# EAGLE schematic Indev 1 (EAGLE 6.3)
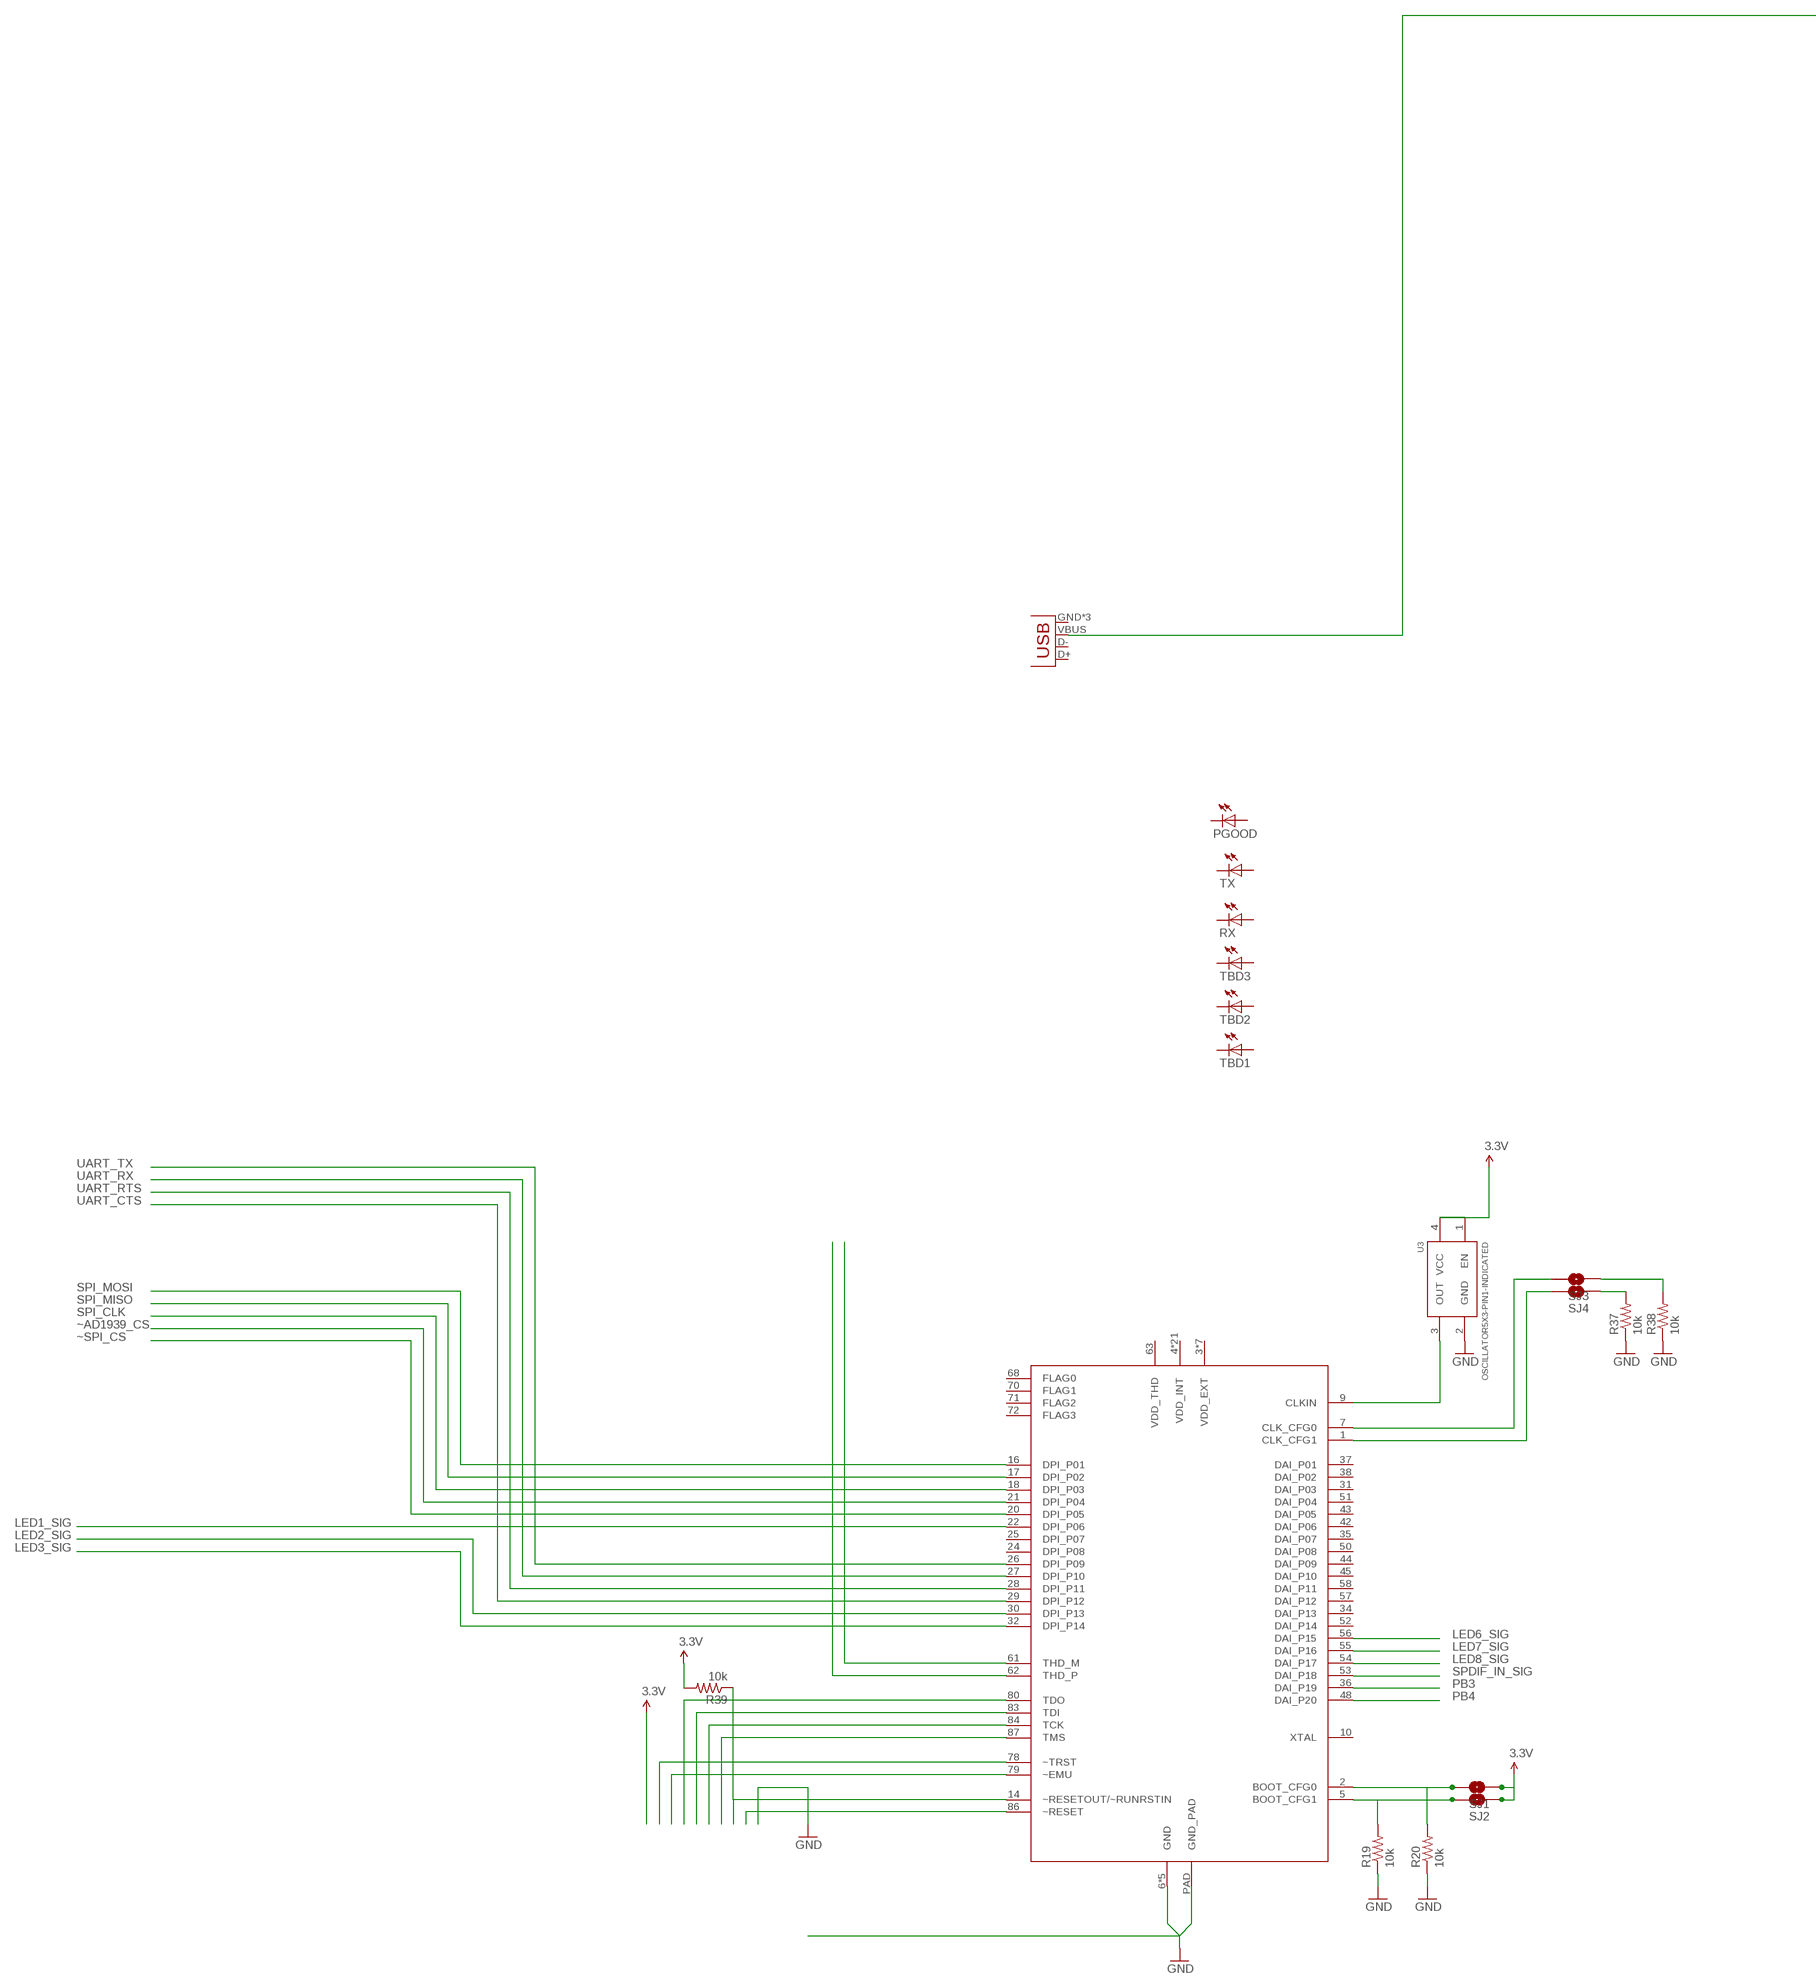
[diagram p0: schematic, sheet 1, part 1 of 2]
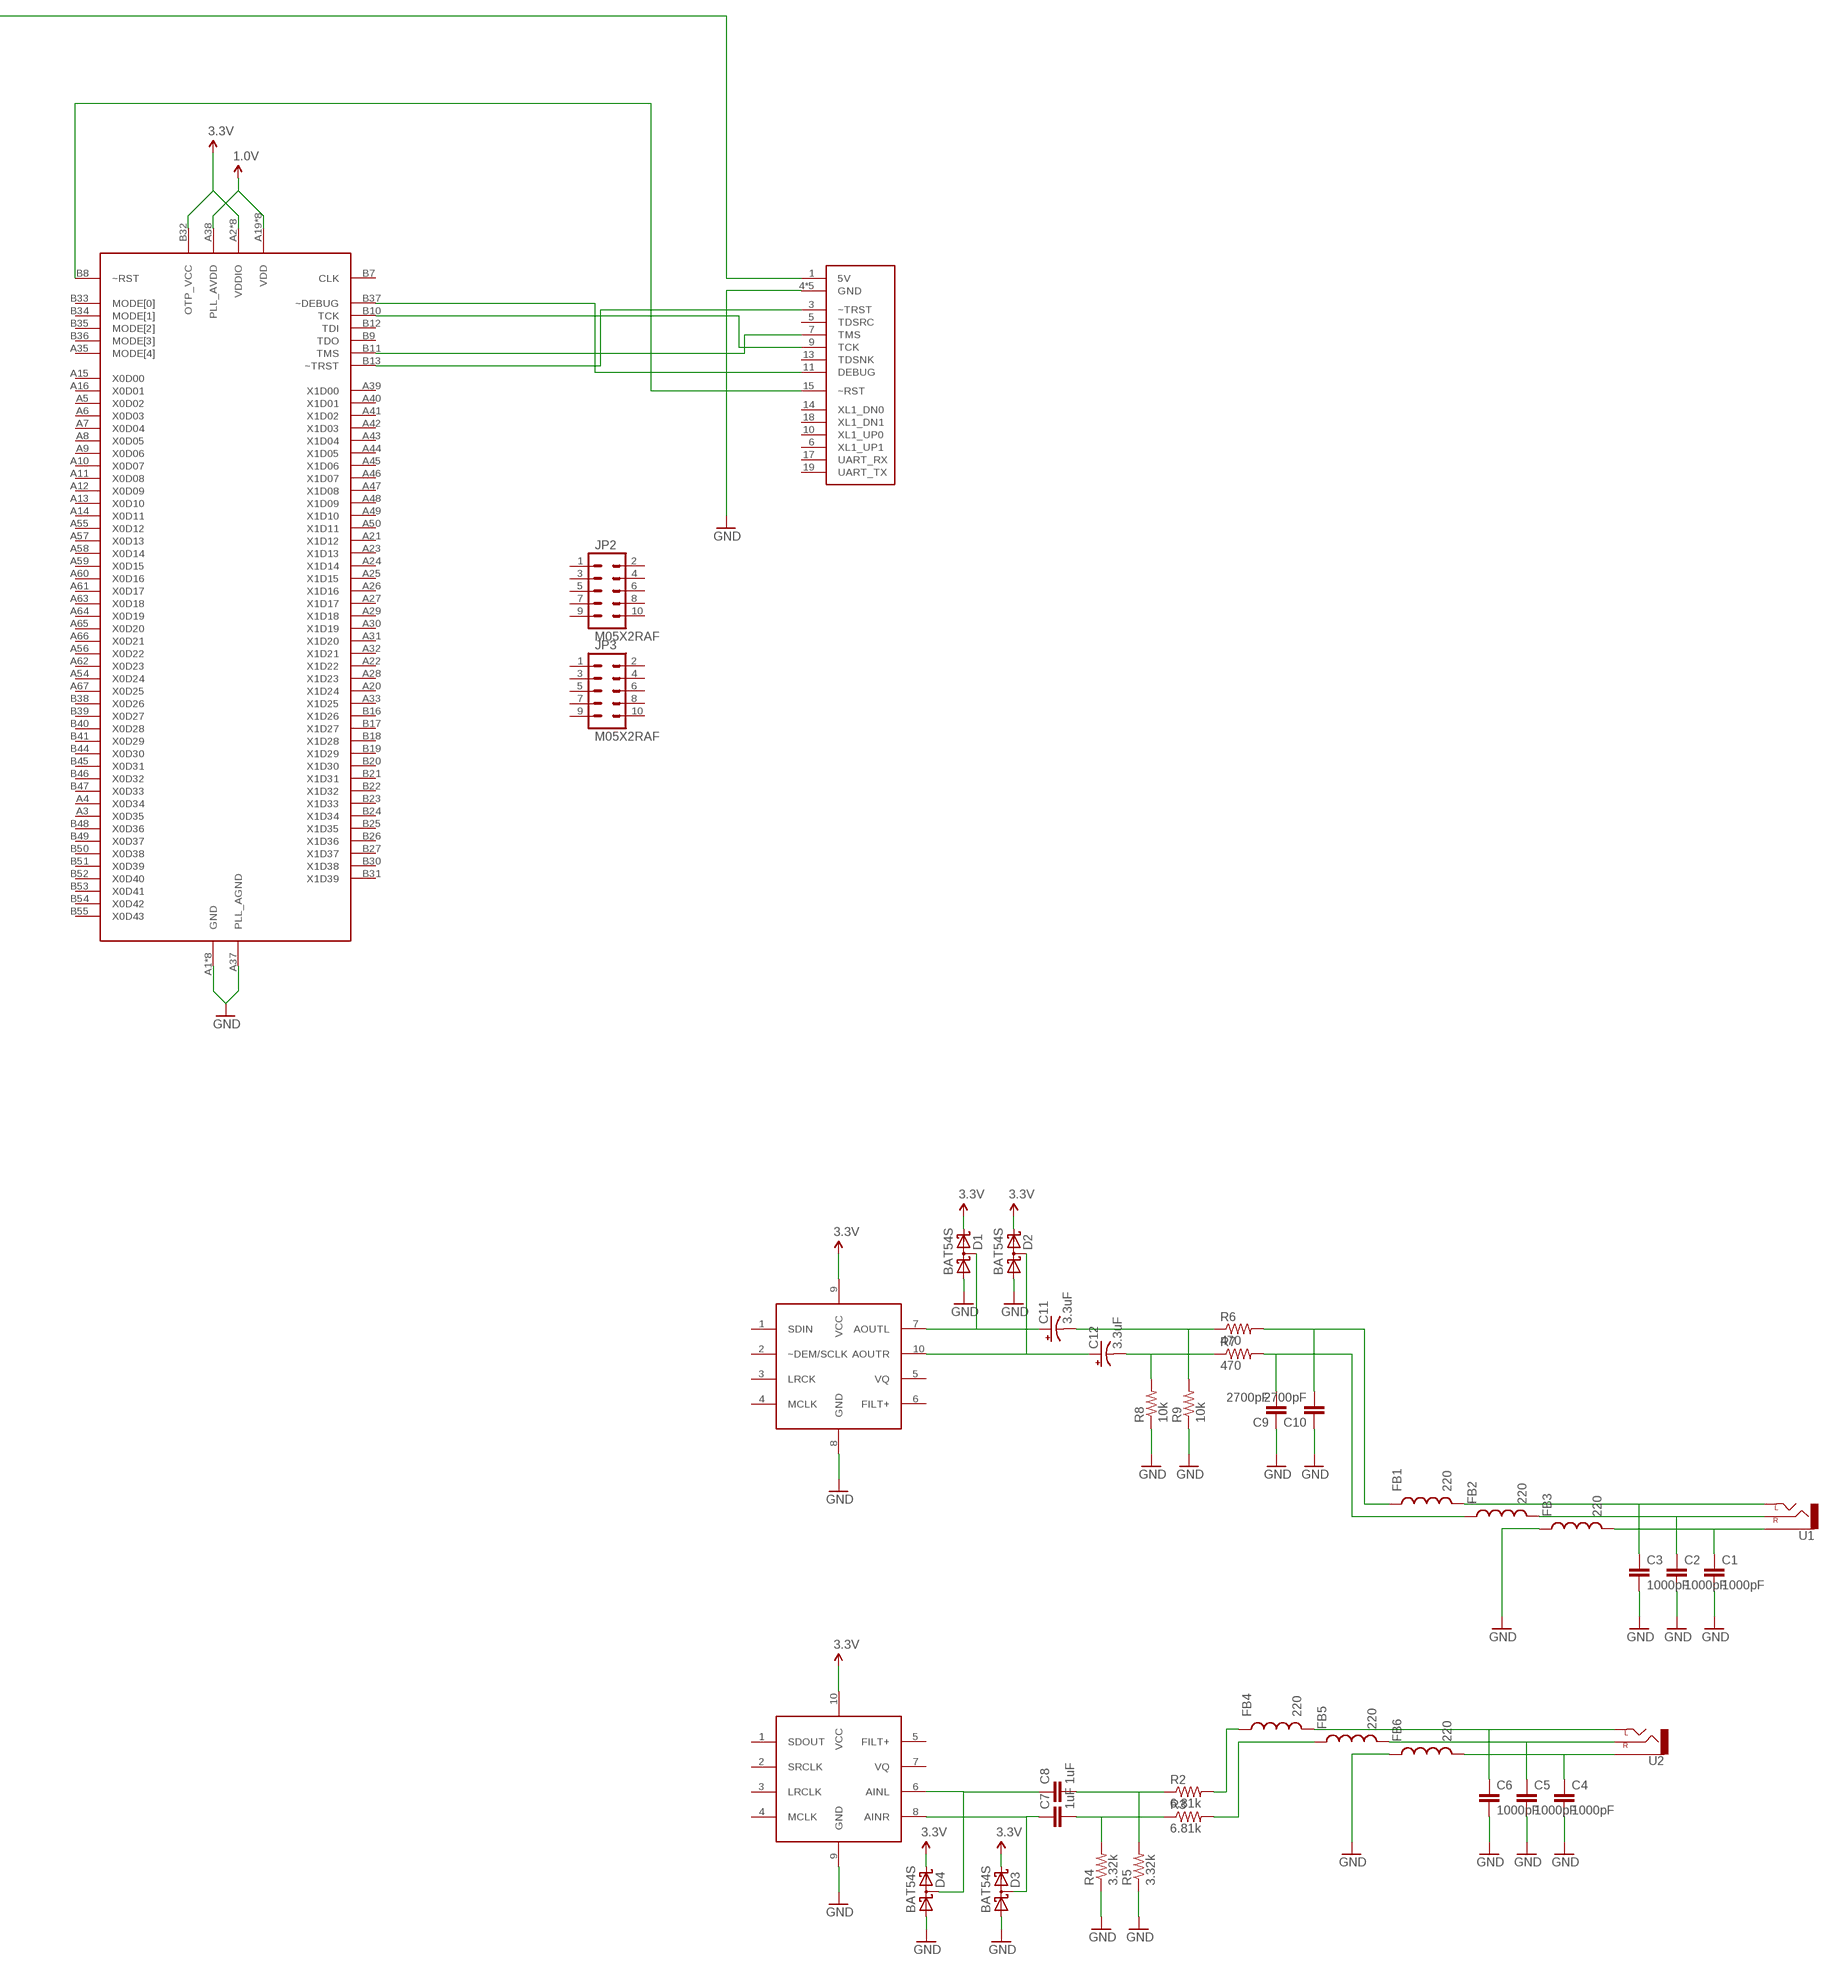
[diagram p1: schematic, sheet 1, part 2 of 2]

## Parts
C1  1000pF  CAP0402-CAP  [0402-CAP]
C2  1000pF  CAP0402-CAP  [0402-CAP]
C3  1000pF  CAP0402-CAP  [0402-CAP]
C4  1000pF  CAP0402-CAP  [0402-CAP]
C5  1000pF  CAP0402-CAP  [0402-CAP]
C6  1000pF  CAP0402-CAP  [0402-CAP]
C7  1uF  CAP0402-CAP  [0402-CAP]
C8  1uF  CAP0402-CAP  [0402-CAP]
C9  2700pF  CAP0402-CAP  [0402-CAP]
C10  2700pF  CAP0402-CAP  [0402-CAP]
C11  3.3uF  CAP_POL1206  [EIA3216]
C12  3.3uF  CAP_POL1206  [EIA3216]
D1  BAT54S  [SOT23]
D2  BAT54S  [SOT23]
D3  BAT54S  [SOT23]
D4  BAT54S  [SOT23]
FB1  220  INDUCTOR0805  [0805]
FB2  220  INDUCTOR0805  [0805]
FB3  220  INDUCTOR0805  [0805]
FB4  220  INDUCTOR0805  [0805]
FB5  220  INDUCTOR0805  [0805]
FB6  220  INDUCTOR0805  [0805]
JP1  USB-MICROB  [USB-MICROB]
JP2  M05X2RAF  [2X5-RAF]
JP3  M05X2RAF  [2X5-RAF]
PGOOD  LEDCHIP-LED0603  [CHIP-LED0603]
R2  6.81k  RESISTOR0603-RES  [0603-RES]
R3  6.81k  RESISTOR0603-RES  [0603-RES]
R4  3.32k  RESISTOR0603-RES  [0603-RES]
R5  3.32k  RESISTOR0603-RES  [0603-RES]
R6  470  RESISTOR0603-RES  [0603-RES]
R7  470  RESISTOR0603-RES  [0603-RES]
R8  10k  RESISTOR0603-RES  [0603-RES]
R9  10k  RESISTOR0603-RES  [0603-RES]
R19  10k  RESISTOR0603-RES  [0603-RES]
R20  10k  RESISTOR0603-RES  [0603-RES]
R37  10k  RESISTOR0603-RES  [0603-RES]
R38  10k  RESISTOR0603-RES  [0603-RES]
R39  10k  RESISTOR0603-RES  [0603-RES]
RX  LEDCHIP-LED0603  [CHIP-LED0603]
SJ1  SOLDERJUMPERNC  [SJ_2S]
SJ2  SOLDERJUMPERNC  [SJ_2S]
SJ3  SOLDERJUMPERNC  [SJ_2S]
SJ4  SOLDERJUMPERNC  [SJ_2S]
TBD1  LEDCHIP-LED0603  [CHIP-LED0603]
TBD2  LEDCHIP-LED0603  [CHIP-LED0603]
TBD3  LEDCHIP-LED0603  [CHIP-LED0603]
TX  LEDCHIP-LED0603  [CHIP-LED0603]
U1  AUDIO-JACKSMD2  [AUDIO-JACK-3.5MM-SMD]
U2  AUDIO-JACKSMD2  [AUDIO-JACK-3.5MM-SMD]
U3  OSCILLATOR5X3-PIN1-INDICATED  [CRYSTAL-OSC-SMD-5X3]
U$1  ADSP-21479  [QFN-88]
U$2  CS4344-DAC  [TSSOP-10]
U$3  CS5343  [TSSOP-10]
U$4  XTAG-2  [MOLEX-52745-2097]
U$6  XS1-L8A-128-QF124  [QFN-124]

## Nets
1.0V: U$6.A19(VDD) U$6.A34(VDD) U$6.A38(PLL_AVDD) U$6.A53(VDD) U$6.A68(VDD) U$6.B15(VDD) U$6.B28(VDD) U$6.B43(VDD) U$6.B56(VDD)
3.3V: R39.2 SJ1.1 SJ2.1 U3.1(EN) U3.4(VCC) U$6.A2(VDDIO) U$6.A17(VDDIO) U$6.A36(VDDIO) U$6.A51(VDDIO) U$6.B1(VDDIO) U$6.B14(VDDIO) U$6.B29(VDDIO) U$6.B32(OTP_VCC) U$6.B42(VDDIO)
AIN_SLEEV: C4.1 FB6.2 U2.SLEEVE
AINL: C6.1 FB4.2 U2.TIP(LEFT)
AINL_C: C8.1 D4.3(C1A2) U$3.6(AINL)
AINL_FB: FB4.1 R2.2
AINL_R: C8.2 R2.1 R5.2
AINR: C5.1 FB5.2 U2.RING(RIGHT)
AINR_C: C7.1 D3.3(C1A2) U$3.8(AINR)
AINR_FB: FB5.1 R3.2
AINR_R: C7.2 R3.1 R4.2
AOUTL: C3.1 FB1.2 U1.TIP(LEFT)
AOUTL_C: C11.A(+) D1.3(C1A2) U$2.7(AOUTL)
AOUTL_FB: C10.2 FB1.1 R6.2
AOUTL_R: C11.C(-) R6.1 R9.2
AOUTR: C2.1 FB2.2 U1.RING(RIGHT)
AOUTR_C: C12.A(+) D2.3(C1A2) U$2.10(AOUTR)
AOUTR_FB: C9.2 FB2.1 R7.2
AOUTR_R: C12.C(-) R7.1 R8.2
AOUTS: C1.1 FB3.2 U1.SLEEVE
GND: C1.2 C2.2 C3.2 C4.2 C5.2 C6.2 C9.1 C10.1 D1.1(A1) D2.1(A1) D3.1(A1) D4.1(A1) FB3.1 FB6.1 R4.1 R5.1 R8.1 R9.1 R19.1 R20.1 R37.1 R38.1 U3.2(GND) U$1.6(GND) U$1.60(GND) U$1.73(GND) U$1.74(GND) U$1.76(GND) U$1.PAD(GND_PAD) U$2.8(GND) U$3.9(GND) U$4.4(GND) U$4.8(GND) U$4.12(GND) U$4.16(GND) U$4.20(GND) U$6.A1(GND) U$6.A18(GND) U$6.A37(PLL_AGND) U$6.A52(GND) U$6.B2(GND) U$6.B4(GND) U$6.B5(GND) U$6.B6(GND) U$6.PAD(GND)
LED1_SIG: U$1.22(DPI_P06)
LED2_SIG: U$1.30(DPI_P13)
LED3_SIG: U$1.32(DPI_P14)
LED6_SIG: U$1.56(DAI_P15)
LED7_SIG: U$1.55(DAI_P16)
LED8_SIG: U$1.54(DAI_P17)
N$1: U$1.78(~TRST)
N$2: JP1.VBUS U$4.1(5V)
N$3: U$4.11(DEBUG) U$6.B37(~DEBUG)
N$4: U3.3(OUT) U$1.9(CLKIN)
N$5: U$4.9(TCK) U$6.B10(TCK)
N$6: U$4.7(TMS) U$6.B11(TMS)
N$7: SJ3.2 U$1.7(CLK_CFG0)
N$8: SJ4.2 U$1.1(CLK_CFG1)
N$9: R37.2 SJ4.1
N$10: U$4.3(~TRST) U$6.B13(~TRST)
N$12: R38.2 SJ3.1
N$14: U$1.79(~EMU)
N$15: U$1.80(TDO)
N$16: U$4.15(~RST) U$6.B8(~RST)
N$18: U$1.83(TDI)
N$19: U$1.84(TCK)
N$20: R20.2 SJ1.2 U$1.2(BOOT_CFG0)
N$21: U$1.87(TMS)
N$25: R39.1 U$1.14(~RESETOUT/~RUNRSTIN)
N$26: U$1.61(THD_M)
N$28: U$1.86(~RESET)
N$37: R19.2 SJ2.2 U$1.5(BOOT_CFG1)
N$38: U$1.62(THD_P)
PB3: U$1.36(DAI_P19)
PB4: U$1.48(DAI_P20)
SPDIF_IN_SIG: U$1.53(DAI_P18)
SPI_CLK: U$1.18(DPI_P03)
SPI_MISO: U$1.17(DPI_P02)
SPI_MOSI: U$1.16(DPI_P01)
UART_CTS: U$1.29(DPI_P12)
UART_RTS: U$1.28(DPI_P11)
UART_RX: U$1.27(DPI_P10)
UART_TX: U$1.26(DPI_P09)
VCC: D1.2(C2) D2.2(C2) D3.2(C2) D4.2(C2) U$2.9(VCC) U$3.10(VCC) ; supply symbol labelled 3.3V
~AD1939_CS: U$1.21(DPI_P04)
~SPI_CS: U$1.20(DPI_P05)
Unconnected: JP1.D+ JP1.D- JP1.GND JP1.MT1(GND) JP1.MT2(GND) JP2.1 JP2.2 JP2.3 JP2.4 JP2.5 JP2.6 JP2.7 JP2.8 JP2.9 JP2.10 JP3.1 JP3.2 JP3.3 JP3.4 JP3.5 JP3.6 JP3.7 JP3.8 JP3.9 JP3.10 PGOOD.A PGOOD.C RX.A RX.C TBD1.A TBD1.C TBD2.A TBD2.C TBD3.A TBD3.C TX.A TX.C U$1.3(VDD_EXT) U$1.4(VDD_INT) U$1.8(VDD_INT) U$1.10(XTAL) U$1.11(VDD_EXT) U$1.12(VDD_INT) U$1.13(VDD_INT) U$1.15(VDD_INT) U$1.19(VDD_INT) U$1.23(VDD_EXT) U$1.24(DPI_P08) U$1.25(DPI_P07) U$1.31(DAI_P03) U$1.33(VDD_INT) U$1.34(DAI_P13) U$1.35(DAI_P07) U$1.37(DAI_P01) U$1.38(DAI_P02) U$1.39(VDD_INT) U$1.40(VDD_EXT) U$1.41(VDD_INT) U$1.42(DAI_P06) U$1.43(DAI_P05) U$1.44(DAI_P09) U$1.45(DAI_P10) U$1.46(VDD_INT) U$1.47(VDD_EXT) U$1.49(VDD_INT) U$1.50(DAI_P08) U$1.51(DAI_P04) U$1.52(DAI_P14) U$1.57(DAI_P12) U$1.58(DAI_P11) U$1.59(VDD_INT) U$1.63(VDD_THD) U$1.64(VDD_INT) U$1.65(VDD_INT) U$1.66(VDD_INT) U$1.67(VDD_INT) U$1.68(FLAG0) U$1.69(VDD_INT) U$1.70(FLAG1) U$1.71(FLAG2) U$1.72(FLAG3) U$1.75(VDD_EXT) U$1.77(VDD_INT) U$1.81(VDD_EXT) U$1.82(VDD_INT) U$1.85(VDD_INT) U$1.88(VDD_INT) U$2.1(SDIN) U$2.2(~DEM/SCLK) U$2.3(LRCK) U$2.4(MCLK) U$2.5(VQ) U$2.6(FILT+) U$3.1(SDOUT) U$3.2(SRCLK) U$3.3(LRCLK) U$3.4(MCLK) U$3.5(FILT+) U$3.7(VQ) U$4.5(TDSRC) U$4.6(XL1_UP1) U$4.10(XL1_UP0) U$4.13(TDSNK) U$4.14(XL1_DN0) U$4.17(UART_RX) U$4.18(XL1_DN1) U$4.19(UART_TX) U$6.A3(X0D35) U$6.A4(X0D34) U$6.A5(X0D02) U$6.A6(X0D03) U$6.A7(X0D04) U$6.A8(X0D05) U$6.A9(X0D06) U$6.A10(X0D07) U$6.A11(X0D08) U$6.A12(X0D09) U$6.A13(X0D10) U$6.A14(X0D11) U$6.A15(X0D00) U$6.A16(X0D01) U$6.A20(X1D24) U$6.A21(X1D12) U$6.A22(X1D22) U$6.A23(X1D13) U$6.A24(X1D14) U$6.A25(X1D15) U$6.A26(X1D16) U$6.A27(X1D17) U$6.A28(X1D23) U$6.A29(X1D18) U$6.A30(X1D19) U$6.A31(X1D20) U$6.A32(X1D21) U$6.A33(X1D25) U$6.A35(MODE[4]) U$6.A39(X1D00) U$6.A40(X1D01) U$6.A41(X1D02) U$6.A42(X1D03) U$6.A43(X1D04) U$6.A44(X1D05) U$6.A45(X1D06) U$6.A46(X1D07) U$6.A47(X1D08) U$6.A48(X1D09) U$6.A49(X1D10) U$6.A50(X1D11) U$6.A54(X0D24) U$6.A55(X0D12) U$6.A56(X0D22) U$6.A57(X0D13) U$6.A58(X0D14) U$6.A59(X0D15) U$6.A60(X0D16) U$6.A61(X0D17) U$6.A62(X0D23) U$6.A63(X0D18) U$6.A64(X0D19) U$6.A65(X0D20) U$6.A66(X0D21) U$6.A67(X0D25) U$6.B7(CLK) U$6.B9(TDO) U$6.B12(TDI) U$6.B16(X1D26) U$6.B17(X1D27) U$6.B18(X1D28) U$6.B19(X1D29) U$6.B20(X1D30) U$6.B21(X1D31) U$6.B22(X1D32) U$6.B23(X1D33) U$6.B24(X1D34) U$6.B25(X1D35) U$6.B26(X1D36) U$6.B27(X1D37) U$6.B30(X1D38) U$6.B31(X1D39) U$6.B33(MODE[0]) U$6.B34(MODE[1]) U$6.B35(MODE[2]) U$6.B36(MODE[3]) U$6.B38(X0D26) U$6.B39(X0D27) U$6.B40(X0D28) U$6.B41(X0D29) U$6.B44(X0D30) U$6.B45(X0D31) U$6.B46(X0D32) U$6.B47(X0D33) U$6.B48(X0D36) U$6.B49(X0D37) U$6.B50(X0D38) U$6.B51(X0D39) U$6.B52(X0D40) U$6.B53(X0D41) U$6.B54(X0D42) U$6.B55(X0D43)

## Library data of the parts
C1-C10 = 1x05smd:CAP: Capacitor Standard 0603 ceramic capacitor, and 0.1" leaded capacitor.
C11 C12 = 1x05smd:CAP_POL: Capacitor Polarized These are standard SMD and PTH capacitors. Normally 10uF, 47uF, and 100uF in electrolytic and tantalum varieties. Always verify the external diameter of the through hole cap, it varies with capacity, voltage, and manufacturer. The EIA devices should be standard.
D1-D4 = diode:BAT54S: Schottky Diodes Pin connection corrected 2011-05-04 Source: Fairchild .. BAT54.pdf
FB1-FB6 = SparkFun-Passives:INDUCTOR: Inductors Basic Inductor/Choke - 0603 and 1206. Footprints are not proven and vary greatly between part numbers.
JP1 = SparkFun-Connectors:USB: USB Connectors USB-B-PTH is fully proven SKU : PRT-00139/CONN-08278 USB-miniB is fully proven SKU : PRT-00587 USB-A-PCB is untested. USB-A-H is throughly reviewed, but untested. Spark Fun Electronics SKU : PRT-00437 USB-B-SMT is throughly reviewed, but untested. Needs silkscreen touching up. USB-A-S has not been used/tested USB-MB-H has not been used/tested USB-MICROB has been used. CONN-09505; PROD_ID: CONN-09505
JP2 JP3 = SparkFun-Connectors:M05X2: Header 5x2 Standard 10-pin dual row 0.1" header. Commonly used with AVR-ISP. Use with Spark Fun Electronics SKU: PRT-00778
PGOOD RX TBD1-TBD3 TX = adafruit:LED: LED OSRAM: - CHIPLED LG R971, LG N971, LY N971, LG Q971, LY Q971, LO R971, LY R971 LH N974, LH R974 LS Q976, LO Q976, LY Q976 LO Q996 - Hyper CHIPLED LW Q18S LB Q993, LB Q99A, LB R99A - SideLED LS A670, LO A670, LY A670, LG A670, LP A670 LB A673, LV A673, LT A673, LW A673 LH A674 LY A675 LS A676, LA A676, LO A676, LY A676, LW A676 LS A679, LY A679, LG A679 - Hyper Micro SIDELED® LS Y876, LA Y876, LO Y876, LY Y876 LT Y87S - SmartLED LW L88C, LW L88S LB L89C, LB L89S, LG L890 LS L89K, LO L89K, LY L89K LS L896, LA L896, LO L896, LY L896 - TOPLED LS T670, LO T670, LY T670, LG T670, LP T670 LSG T670, LSP T670, LSY T670, LOP T670, LYG T670 LG T671, LOG T671, LSG T671 LB T673, LV T673, LT T673, LW T673 LH T674 LS T676, LA T676, LO T676, LY T676, LB T676, LH T676, LSB T676, LW T676 LB T67C, LV T67C, LT T67C, LS T67K, LO T67K, LY T67K, LW E67C LS E67B, LA E67B, LO E67B, LY E67B, LB E67C, LV E67C, LT E67C LW T67C LS T679, LY T679, LG T679 LS T770, LO T770, LY T770, LG T770, LP T770 LB T773, LV T773, LT T773, LW T773 LH T774 LS E675, LA E675, LY E675, LS T675 LS T776, LA T776, LO T776, LY T776, LB T776 LHGB T686 LT T68C, LB T68C - Hyper Mini TOPLED® LB M676 - Mini TOPLED Santana® LG M470 LS M47K, LO M47K, LY M47K Source: http://www.osram.convergy.de/
R2-R9 R19 R20 R37-R39 = 1x05smd:RESISTOR: Resistor Basic schematic elements and footprints for 0603, 1206, and PTH 1/10th watt (small) resistors.
SJ1-SJ4 = 1x05smd:SOLDERJUMPER: Solder Jumper Standard SMD solder jumper. Used to automate production. Two varients : Normally Open and Normally Closed are the same, but have different paste layers. NC will have a large amount of paste and should jumper during reflow.
U1 U2 = SparkFun-Connectors:AUDIO-JACK: 3.5mm Audio Jack Simple 3.5mm common PCB mount audio jack. SKU: PRT-08032
U3 = SparkFun-FreqCtrl:OSCILLATOR: Generic 5x3 and 7x5 oscillators
U$1 = Strutz Electronic Industries:ADSP-21479
U$2 = Strutz Electronic Industries:CS4344-DAC
U$3 = Strutz Electronic Industries:CS5343
U$4 = Strutz Electronic Industries:XTAG-2
U$6 = Strutz Electronic Industries:XS1-L8A-128-QF124